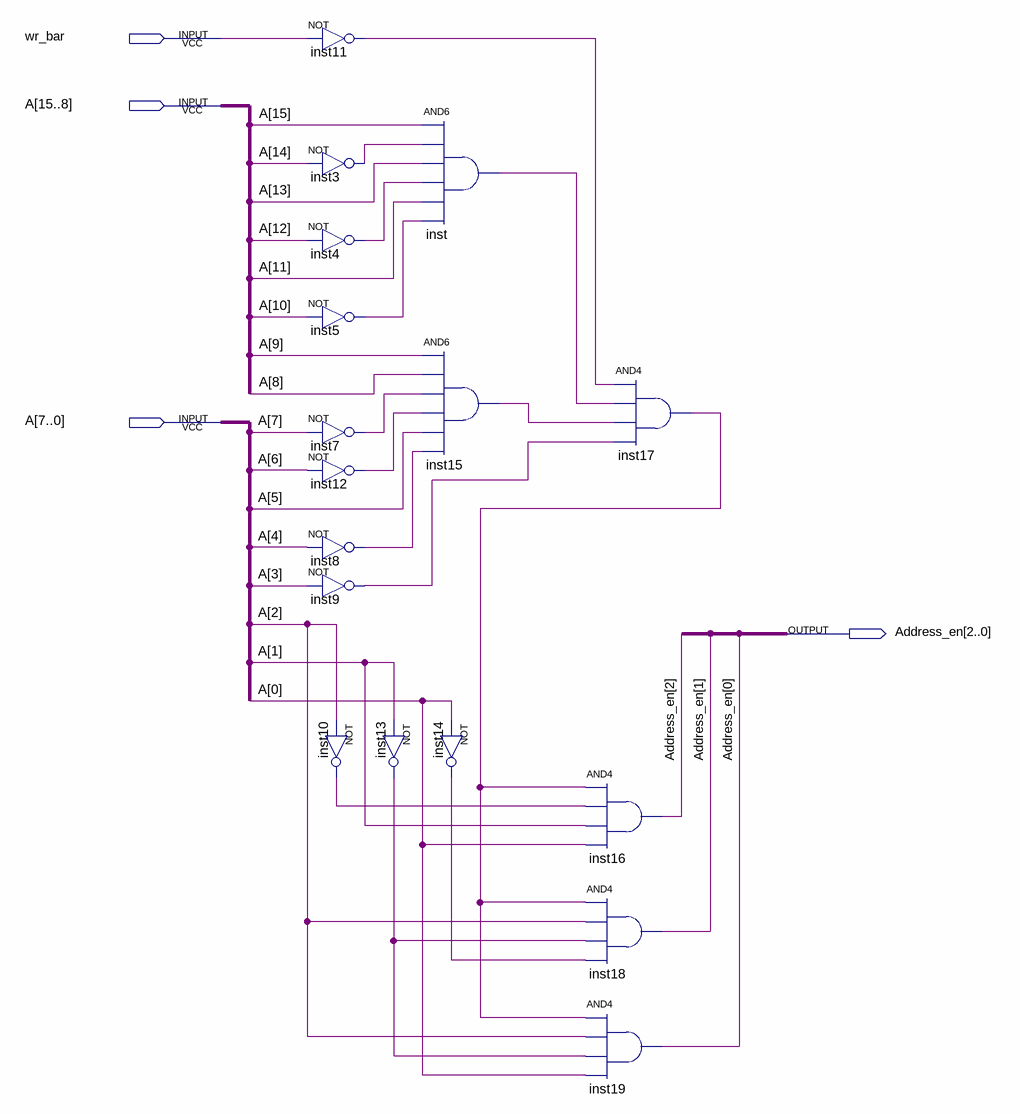
[diagram p0: schematic sheet]
// Quartus schematic address_decoder.bdf as structural Verilog: 17 symbols, 4 pins
module address_decoder (
  input  wr_bar,
  input  [15:0] A,
  output [2:0] Address_en
);

  wire inst3_out, inst4_out, inst5_out, inst7_out, inst8_out, inst9_out, inst10_out, inst11_out, inst12_out,
       inst13_out, inst14_out, inst15_out, inst17_out, inst_out;

  not inst11 (inst11_out, wr_bar);
  not inst3 (inst3_out, A[14]);
  not inst4 (inst4_out, A[12]);
  not inst5 (inst5_out, A[10]);
  not inst7 (inst7_out, A[7]);
  not inst12 (inst12_out, A[6]);
  not inst8 (inst8_out, A[4]);
  not inst9 (inst9_out, A[3]);
  not inst10 (inst10_out, A[2]);
  not inst13 (inst13_out, A[1]);
  and inst (inst_out, A[15], inst3_out, A[13], inst4_out, A[11], inst5_out);
  and inst15 (inst15_out, A[9], A[8], inst7_out, inst12_out, A[5], inst8_out);
  not inst14 (inst14_out, A[0]);
  and inst17 (inst17_out, inst11_out, inst_out, inst15_out, inst9_out);
  and inst16 (Address_en[2], inst17_out, inst10_out, A[1], A[0]);
  and inst18 (Address_en[1], inst17_out, A[2], inst13_out, inst14_out);
  and inst19 (Address_en[0], inst17_out, A[2], inst13_out, A[0]);
endmodule
